# EAGLE schematic darpa-motor control (EAGLE 9.6.0)
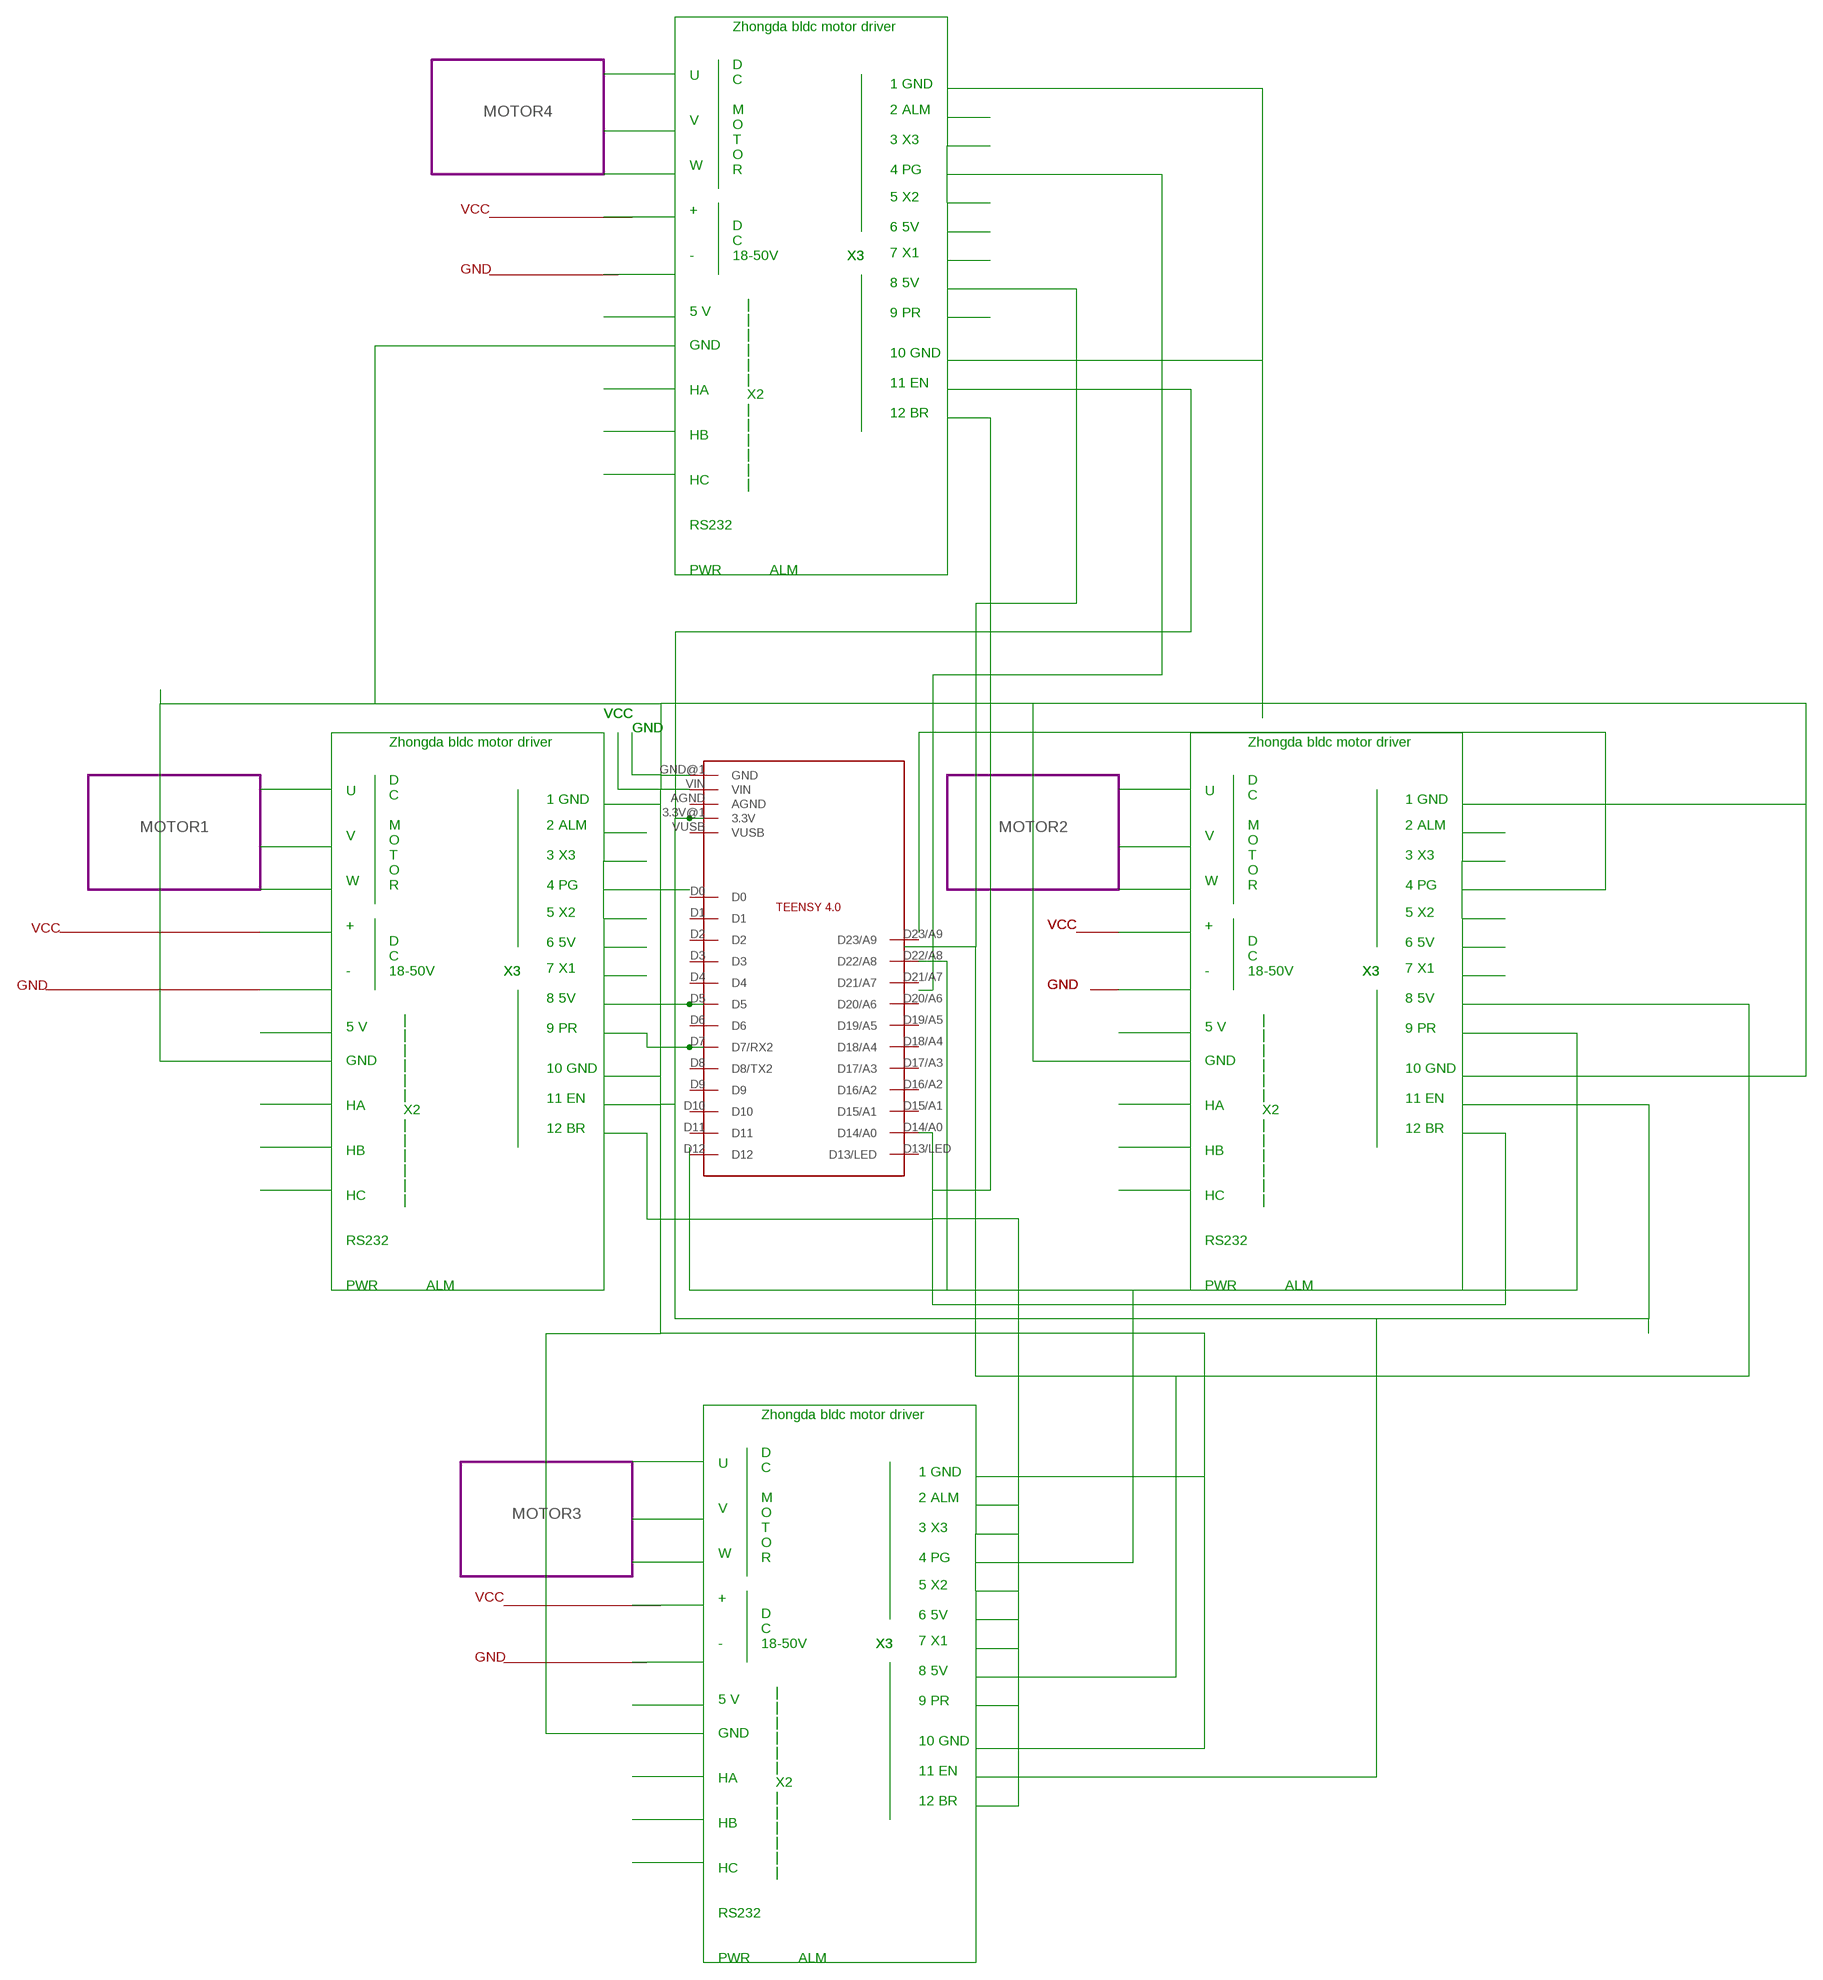
[diagram p0: schematic, sheet 1]

## Parts
MC1  TEENSY4.0_SIMPLE  [TEENSY4.0_SIMPLE]

## Module instances
MOTOR1 = MOTOR
MOTOR2 = MOTOR
MOTOR3 = MOTOR
MOTOR4 = MOTOR

## Nets
N$1: MC1.VIN
N$16: MC1.3.3V@1(3.3V) MC1.D5 MC1.D7(D7/RX2) MC1.D14/A0 MC1.D22/A8 MC1.GND@1(GND)
Unconnected: MC1.AGND MC1.D0 MC1.D1 MC1.D2 MC1.D3 MC1.D4 MC1.D6 MC1.D8(D8/TX2) MC1.D9 MC1.D10 MC1.D11 MC1.D12 MC1.D13/LED MC1.D15/A1 MC1.D16/A2 MC1.D17/A3 MC1.D18/A4 MC1.D19/A5 MC1.D20/A6 MC1.D21/A7 MC1.D23/A9 MC1.VUSB

## Notes on the sheet
- Zhongda bldc motor driver
- 1 GND
- D
  C
  
  M
  O
  T
  O
  R
- 2 ALM
  
  3 X3
  
  4 PG
- 5 X2
  
  6 5V
- U
  
  
  V
  
  
  W
  
  
  +
  
  
  -
- D
  C
  18-50V
- X3 | X3
- VCC
  
  
  
  GND
- 7 X1
  
  8 5V
  
  9 PR
- 5 V
- 10 GND
  
  11 EN
  
  12 BR
- |
  |
  |
  |
  |
  |
  X2
  |
  |
  |
  |
  |
  |
- GND
  
  
  HA
  
  
  HB
  
  
  HC
  
  
  RS232
  
  
  PWR            ALM
- VCC | VCC
- GND | GND
- Zhongda bldc motor driver | Zhongda bldc motor driver
- 1 GND | 1 GND
- D
  C
  
  M
  O
  T
  O
  R
- 2 ALM
  
  3 X3
  
  4 PG
- D
  C
  
  M
  O
  T
  O
  R
- 2 ALM
  
  3 X3
  
  4 PG
- VCC
- 5 X2
  
  6 5V
- 5 X2
  
  6 5V
- U
  
  
  V
  
  
  W
  
  
  +
  
  
  -
- D
  C
  18-50V
- X3 | X3
- U
  
  
  V
  
  
  W
  
  
  +
  
  
  -
- D
  C
  18-50V
- X3 | X3
- GND
- VCC
  
  
  
  GND
- VCC
  
  
  
  GND
- 7 X1
  
  8 5V
  
  9 PR
- 7 X1
  
  8 5V
  
  9 PR
- 5 V | 5 V
- 10 GND
  
  11 EN
  
  12 BR
- 10 GND
  
  11 EN
  
  12 BR
- |
  |
  |
  |
  |
  |
  X2
  |
  |
  |
  |
  |
  |
- |
  |
  |
  |
  |
  |
  X2
  |
  |
  |
  |
  |
  |
- GND
  
  
  HA
  
  
  HB
  
  
  HC
  
  
  RS232
  
  
  PWR            ALM
- GND
  
  
  HA
  
  
  HB
  
  
  HC
  
  
  RS232
  
  
  PWR            ALM
- Zhongda bldc motor driver
- 1 GND
- D
  C
  
  M
  O
  T
  O
  R
- 2 ALM
  
  3 X3
  
  4 PG
- 5 X2
  
  6 5V
- U
  
  
  V
  
  
  W
  
  
  +
  
  
  -
- D
  C
  18-50V
- X3 | X3
- VCC
  
  
  
  GND
- 7 X1
  
  8 5V
  
  9 PR
- 5 V
- 10 GND
  
  11 EN
  
  12 BR
- |
  |
  |
  |
  |
  |
  X2
  |
  |
  |
  |
  |
  |
- GND
  
  
  HA
  
  
  HB
  
  
  HC
  
  
  RS232
  
  
  PWR            ALM

## Library data of the parts
MC1 = Teensy4.0_SIMPLE:TEENSY4.0_SIMPLE: Tennsy 4.0 simple layout (no underside pins)

## Module MOTOR
Ports: 

### Library data of the parts